# Altium project PCB_Project.PrjPcb (part 3 of 3)
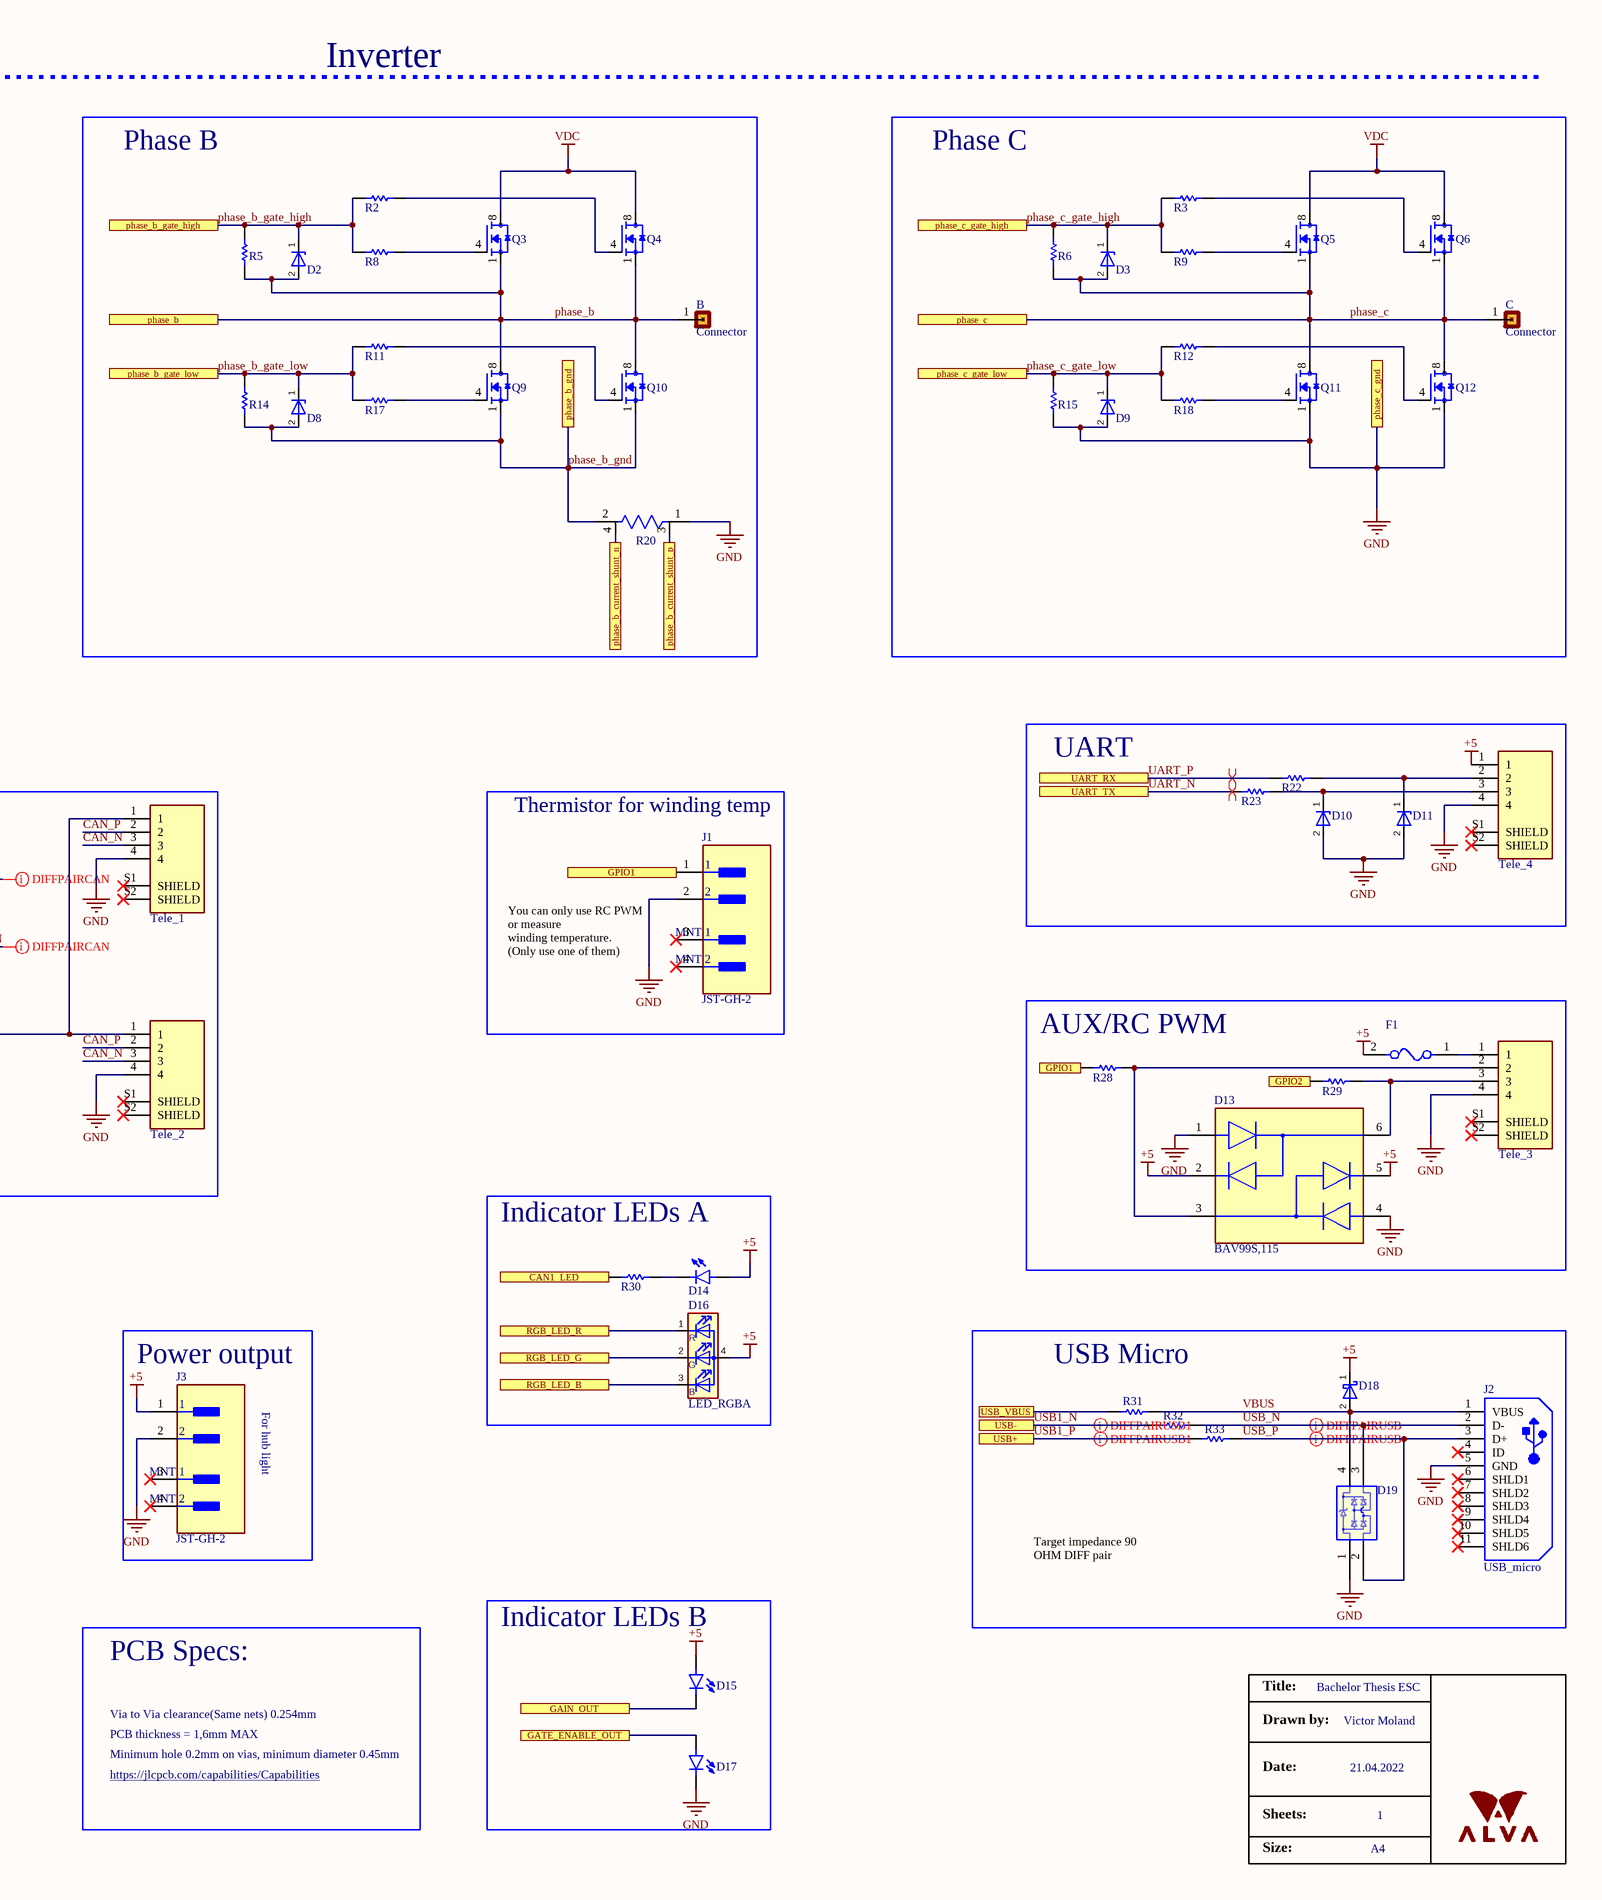
[diagram p4: thesis.SchDoc, right]

## Sheet thesis.SchDoc: Bachelor Thesis ESC (continued)

### Library data of the parts (continued)
R26 = RES_0603: Fixed Resistor, Metal Glaze/thick Film, 0.25W, 200ohm, 150V, 1% +/-Tol, 100ppm/Cel, Surface Mount, 0603; Manufacturer: Rohm; Manufacturer Part Number: ESR03EZPF2000; Rated Power Dissipation (P): 250mW; Rated Temperature: 70°C; Resistance: 200R; Temperature Coefficient: 100ppm/°C; Package Height: 0.45mm; Package Length: 1.6mm; Package Width: 0.8mm; Reference Standard: TS 16949; Supplier 1: Digi-Key; Supplier Part Number 1: RHM200ADCT-ND; RoHS: Yes; Category: Chip SMD Resistors; Stock 1: 954650; Pricing 1: 1=0,15000, 10=0,13200, 100=0,05060, 1000=0,02226, 2500=0,01923 (USD); Mount: Surface Mount; Number of Pins: 2; Package Shape: Rectangular; Size Code: 0603; Terminal Finish: Nickel; Min Operating Temperature: -55°C; Max Operating Temperature: 155°C; Tolerance: 1%; JESD-609 Code: e3; Resistor Type: FIXED RESISTOR; Construction: Chip; Package Style: SMTMeter; Packaging: Tape and Reel; Technology: METAL GLAZE/THICK FILM; Termination: Wraparound; Working Voltage: 150V; REACH SVHC: Yes; RoHS Compliant: Yes; ComponentLink1URL: https://datasheet.ciiva.com:443/pdfs/VipMasterIC/IC/ROHM/ROHM-S-A0009647586/ROHM-S-A0009647586-1.pdf?src-supplier=IHS+Markit; ComponentLink1Description: https://datasheet.ciiva.com:443/pdfs/VipMasterIC/IC/ROHM/ROHM-S-A0009647586/ROHM-S-A0009647586-1.pdf?src-supplier=IHS+Markit; ComponentLink2URL: https://datasheet.ciiva.com/2469/esr-2469706.pdf?src-supplier=Digi-Key; ComponentLink2Description: https://datasheet.ciiva.com/2469/esr-2469706.pdf?src-supplier=Digi-Key; ComponentLink3URL: https://datasheet.ciiva.com/2469/esr-2469707.pdf?src-supplier=Digi-Key; ComponentLink3Description: https://datasheet.ciiva.com/2469/esr-2469707.pdf?src-supplier=Digi-Key; ComponentLink4URL: https://datasheet.ciiva.com/2469/esr-2469708.pdf?src-supplier=Digi-Key; ComponentLink4Description: https://datasheet.ciiva.com/2469/esr-2469708.pdf?src-supplier=Digi-Key
R27 = RES_0603: Fixed Resistor, Thin Film, 0.1W, 45900ohm, 75V, 1% +/-Tol, 100ppm/Cel, Surface Mount, 0603; Manufacturer: KOA Speer; Manufacturer Part Number: RN73H1JTTD4592F100; Supplier 1: Digi-Key; Supplier Part Number 1: 2019-RN73H1JTTD4592F100CT-ND; RoHS: Yes; Category: Resistors; Stock 1: 16463; Pricing 1: 1=0,39000, 10=0,29700, 100=0,12480, 1000=0,06888, 2500=0,06458 (USD); ComponentLink1URL: https://datasheet.ciiva.com:443/pdfs/VipMasterIC/IC/KOAS/KOAS-S-A0009586296/KOAS-S-A0009586296-1.pdf?src-supplier=IHS+Markit; ComponentLink1Description: https://datasheet.ciiva.com:443/pdfs/VipMasterIC/IC/KOAS/KOAS-S-A0009586296/KOAS-S-A0009586296-1.pdf?src-supplier=IHS+Markit; ComponentLink2URL: http://www.mouser.com/ds/2/219/RN73H-12200.pdf?src-supplier=Mouser; ComponentLink2Description: http://www.mouser.com/ds/2/219/RN73H-12200.pdf?src-supplier=Mouser
R28 R29 = RES_0603: Chip Resistor; Manufacturer: Panasonic; Manufacturer Part Number: ERJ-UP3F1000V; Supplier 1: Digi-Key; Supplier Part Number 1: 10-ERJ-UP3F1000VCT-ND; RoHS: No; Category: Chip SMD Resistors; Stock 1: 5872; Pricing 1: 1=0,27000, 10=0,22800, 100=0,08920, 1000=0,03735, 2500=0,03424 (USD)
R34 = RES_0603: Fixed Resistor, Metal Glaze/thick Film, 0.1W, 510ohm, 75V, 1% +/-Tol, 100ppm/Cel, Surface Mount, 0603; Manufacturer: Panasonic; Manufacturer Part Number: ERJ-3EKF5100V; Rated Power Dissipation (P): 100mW; Rated Temperature: 70°C; Resistance: 510R; Temperature Coefficient: 100ppm/°C; Package Height: 0.45mm; Package Length: 1.6mm; Package Width: 0.8mm; Reference Standard: AEC-Q200; Supplier 1: Digi-Key; Supplier Part Number 1: P510HCT-ND; RoHS: Yes; Category: Chip SMD Resistors; Stock 1: 30608; Pricing 1: 1=0,10000, 10=0,05300, 100=0,02140, 1000=0,00961, 2500=0,00834 (USD); Mount: Surface Mount; Number of Pins: 2; Package Shape: Rectangular; Size Code: 0603; Terminal Finish: Nickel; Min Operating Temperature: -55°C; Max Operating Temperature: 155°C; Tolerance: 1%; JESD-609 Code: e3; Resistor Type: FIXED RESISTOR; Construction: Rectangular; Package Style: SMTMeter; Packaging: Tape and Reel; Technology: METAL GLAZE/THICK FILM; Termination: Wraparound; Working Voltage: 75V; REACH SVHC: Yes; RoHS Compliant: Yes; ComponentLink1URL: https://datasheet.ciiva.com:443/pdfs/VipMasterIC/IC/PANA/PANA-S-A0009889626/PANA-S-A0009889626-1.pdf?src-supplier=IHS+Markit; ComponentLink1Description: https://datasheet.ciiva.com:443/pdfs/VipMasterIC/IC/PANA/PANA-S-A0009889626/PANA-S-A0009889626-1.pdf?src-supplier=IHS+Markit; ComponentLink2URL: https://datasheet.ciiva.com/46436/426256-46436792.pdf?src-supplier=Element14; ComponentLink2Description: https://datasheet.ciiva.com/46436/426256-46436792.pdf?src-supplier=Element14; ComponentLink3URL: https://datasheet.ciiva.com/5868/426256-5868140.pdf?src-supplier=Farnell; ComponentLink3Description: https://datasheet.ciiva.com/5868/426256-5868140.pdf?src-supplier=Farnell; ComponentLink4URL: https://datasheet.ciiva.com/28565/1678782-28565126.pdf?src-supplier=Element14; ComponentLink4Description: https://datasheet.ciiva.com/28565/1678782-28565126.pdf?src-supplier=Element14; ComponentLink5URL: https://datasheet.ciiva.com/28676/1678782-28676970.pdf?src-supplier=Element14; ComponentLink5Description: https://datasheet.ciiva.com/28676/1678782-28676970.pdf?src-supplier=Element14; ComponentLink6URL: https://datasheet.ciiva.com/24027/aoa0000ce2-24027562.pdf?src-supplier=Mouser; ComponentLink6Description: https://datasheet.ciiva.com/24027/aoa0000ce2-24027562.pdf?src-supplier=Mouser; ComponentLink7URL: https://datasheet.ciiva.com/16787/70260748-16787975.pdf?src-supplier=Allied+Electronics; ComponentLink7Description: https://datasheet.ciiva.com/16787/70260748-16787975.pdf?src-supplier=Allied+Electronics; ComponentLink8URL: https://datasheet.ciiva.com/16775/70260748-16775519.pdf?src-supplier=Allied+Electronics; ComponentLink8Description: https://datasheet.ciiva.com/16775/70260748-16775519.pdf?src-supplier=Allied+Electronics; ComponentLink9URL: https://datasheet.ciiva.com/9181/aoa0000ce2-9181526.pdf?src-supplier=Avnet; ComponentLink9Description: https://datasheet.ciiva.com/9181/aoa0000ce2-9181526.pdf?src-supplier=Avnet; ComponentLink10URL: https://datasheet.ciiva.com/9181/aoa0000ce2-9181437.pdf?src-supplier=Avnet; ComponentLink10Description: https://datasheet.ciiva.com/9181/aoa0000ce2-9181437.pdf?src-supplier=Avnet; ComponentLink11URL: https://datasheet.ciiva.com/30146/aoa0000ce2-30146815.pdf?src-supplier=Onlinecomponents.com; ComponentLink11Description: https://datasheet.ciiva.com/30146/aoa0000ce2-30146815.pdf?src-supplier=Onlinecomponents.com
R35 = RES_0603: Fixed Resistor, Metal Glaze/thick Film, 0.1W, 15ohm, 75V, 1% +/-Tol, 100ppm/Cel, Surface Mount, 0603; Manufacturer: Panasonic; Manufacturer Part Number: ERJ-3EKF15R0V; Rated Power Dissipation (P): 100mW; Rated Temperature: 70°C; Resistance: 15R; Temperature Coefficient: 100ppm/°C; Package Height: 0.45mm; Package Length: 1.6mm; Package Width: 0.8mm; Reference Standard: AEC-Q200; Supplier 1: Digi-Key; Supplier Part Number 1: P15.0HCT-ND; RoHS: Yes; Category: Chip SMD Resistors; Stock 1: 131286; Pricing 1: 1=0,10000, 10=0,05300, 100=0,02140, 1000=0,00961, 2500=0,00834 (USD); Mount: Surface Mount; Number of Pins: 2; Package Shape: Rectangular; Size Code: 0603; Terminal Finish: Nickel; Min Operating Temperature: -55°C; Max Operating Temperature: 155°C; Tolerance: 1%; JESD-609 Code: e3; Resistor Type: FIXED RESISTOR; Construction: Rectangular; Package Style: SMTMeter; Packaging: Tape and Reel; Technology: METAL GLAZE/THICK FILM; Termination: Wraparound; Working Voltage: 75V; REACH SVHC: Yes; RoHS Compliant: Yes; ComponentLink1URL: https://datasheet.ciiva.com:443/pdfs/VipMasterIC/IC/PANA/PANA-S-A0009889626/PANA-S-A0009889626-1.pdf?src-supplier=IHS+Markit; ComponentLink1Description: https://datasheet.ciiva.com:443/pdfs/VipMasterIC/IC/PANA/PANA-S-A0009889626/PANA-S-A0009889626-1.pdf?src-supplier=IHS+Markit; ComponentLink2URL: https://datasheet.ciiva.com/5915/aoa0000ce2-5915293.pdf?src-supplier=Farnell; ComponentLink2Description: https://datasheet.ciiva.com/5915/aoa0000ce2-5915293.pdf?src-supplier=Farnell; ComponentLink3URL: https://datasheet.ciiva.com/46373/1678782-46373801.pdf?src-supplier=Element14; ComponentLink3Description: https://datasheet.ciiva.com/46373/1678782-46373801.pdf?src-supplier=Element14; ComponentLink4URL: https://datasheet.ciiva.com/22682/1678782-22682189.pdf?src-supplier=Element14; ComponentLink4Description: https://datasheet.ciiva.com/22682/1678782-22682189.pdf?src-supplier=Element14; ComponentLink5URL: https://datasheet.ciiva.com/46373/1678782-46373800.pdf?src-supplier=Element14; ComponentLink5Description: https://datasheet.ciiva.com/46373/1678782-46373800.pdf?src-supplier=Element14; ComponentLink6URL: https://datasheet.ciiva.com/16770/70260748-16770860.pdf?src-supplier=Allied+Electronics; ComponentLink6Description: https://datasheet.ciiva.com/16770/70260748-16770860.pdf?src-supplier=Allied+Electronics; ComponentLink7URL: https://datasheet.ciiva.com/9192/aoa0000ce2-9192958.pdf?src-supplier=Avnet; ComponentLink7Description: https://datasheet.ciiva.com/9192/aoa0000ce2-9192958.pdf?src-supplier=Avnet; ComponentLink8URL: https://datasheet.ciiva.com/30238/aoa0000ce2-30238940.pdf?src-supplier=Onlinecomponents.com; ComponentLink8Description: https://datasheet.ciiva.com/30238/aoa0000ce2-30238940.pdf?src-supplier=Onlinecomponents.com
Tele_1-Tele_4 = JST-GH-4: Conn Shrouded Header HDR 4 POS 1.25mm Solder ST Top Entry SMD T/R; Manufacturer: JST; Manufacturer Part Number: BM04B-GHS-TBT(LF)(SN)(N); Supplier 1: Digi-Key; RoHS: Yes; Category: Headers and Wire Housings; Pricing 1: 1=0,47000, 10=0,40400, 100=0,31390, 500=0,26908, 1000=0,22423 (USD); ComponentLink1URL: http://www.jst-mfg.com/product/pdf/eng/eGH.pdf?src-supplier=Digi-Key; ComponentLink1Description: http://www.jst-mfg.com/product/pdf/eng/eGH.pdf?src-supplier=Digi-Key; ComponentLink2URL: http://www.jst-mfg.com/product/pdf/eng/eGH.pdf?src-supplier=Component+Distributors+Inc.; ComponentLink2Description: http://www.jst-mfg.com/product/pdf/eng/eGH.pdf?src-supplier=Component+Distributors+Inc.; Supplier Part Number 1: 455-1580-1-ND
U1 = MCP2544FDT-E_MNY: Interface Circuit, PDSO8; Manufacturer: Microchip; Manufacturer Part Number: MCP2544FDT-E/MNY; Package Body Material: Plastic; Number of Functions: 1; Supply Voltage-Nom: 5V; Supplier 1: Digi-Key; RoHS: Yes; Category: Interface ICs; Pricing 1: 1=1,09000, 25=0,91160, 100=0,82680 (USD); Package Code: HVSON; Number of Pins: 8; Package Shape: Rectangular; Terminal Finish: Nickel; Min Operating Temperature: -40°C; Max Operating Temperature: 125°C; JESD-609 Code: e4; JESD-30 Code: R-PDSO-N8; Package Style: SMALL OUTLINE, HEAT SINK/SLUG, VERY THIN PROFILEMeter; Surface Mount: Yes; Telecom IC Type: INTERFACE CIRCUIT; Terminal Form: No Lead; Terminal Position: DUAL; Length: 3mm; Width: 2mm; Height - Seated (Max): 0.8mm; Terminal Pitch: 0.5mm; Temperature Grade: AUTOMOTIVE; REACH SVHC: Yes; RoHS Compliant: Yes; ComponentLink1URL: https://datasheet.ciiva.com:443/pdfs/VipMasterIC/IC/MCHP/MCHP-S-A0008004102/MCHP-S-A0008004102-1.pdf?src-supplier=IHS+Markit; ComponentLink1Description: https://datasheet.ciiva.com:443/pdfs/VipMasterIC/IC/MCHP/MCHP-S-A0008004102/MCHP-S-A0008004102-1.pdf?src-supplier=IHS+Markit; ComponentLink2URL: http://www.microchip.com/mymicrochip/filehandler.aspx?ddocname=en585412&src-supplier=Digi-Key; ComponentLink2Description: http://www.microchip.com/mymicrochip/filehandler.aspx?ddocname=en585412&src-supplier=Digi-Key; Supplier Part Number 1: MCP2544FDT-E/MNYDKR-ND
U2 = MAX4995A: Analog Circuit, 1 Func, BICMOS, PDSO6; Manufacturer: Maxim; Package Body Material: Plastic; Number of Functions: 1; Power Supplies: 1.8/5V; Supply Current-Max (Isup): 300uA; Supply Voltage-Max (Vsup): 5.5V; Supply Voltage-Min (Vsup): 1.7V; Supply Voltage-Nom (Vsup): 3.3V; Package Equivalence Code: TSOP6,.11,37; Qualification Status: Not Qualified; Supplier 1: Digi-Key; Manufacturer Part Number: MAX4995AAUT+T; RoHS: Yes; Category: Power Management ICs; Package Code: LSSOP; Number of Pins: 6; Package Shape: Rectangular; Terminal Finish: Nickel; Min Operating Temperature: -40°C; Max Operating Temperature: 125°C; Analog IC - Other Type: ANALOG CIRCUIT; Moisture Sensitivity Level: 1; Package Style: SMALL OUTLINE, LOW PROFILE, SHRINK PITCHMeter; Surface Mount: Yes; Technology: BICMOS; Terminal Form: Gull Wing; Terminal Position: DUAL; JESD-609 Code: e4; Peak Reflow Temperature (Cel): 260°C; JESD-30 Code: R-PDSO-G6; Length: 2.9mm; Width: 1.625mm; Height - Seated (Max): 1.45mm; Terminal Pitch: 0.95mm; Temperature Grade: AUTOMOTIVE; REACH SVHC: Yes; RoHS Compliant: Yes; ComponentLink1URL: https://datasheet.ciiva.com:443/pdfs/VipMasterIC/IC/MAXM/MAXM-S-A0009149963/MAXM-S-A0009149963-1.pdf?src-supplier=IHS+Markit; ComponentLink1Description: https://datasheet.ciiva.com:443/pdfs/VipMasterIC/IC/MAXM/MAXM-S-A0009149963/MAXM-S-A0009149963-1.pdf?src-supplier=IHS+Markit; ComponentLink2URL: https://datasheet.ciiva.com/3216/max4995a-max4995c-3216988.pdf?src-supplier=Avnet; ComponentLink2Description: https://datasheet.ciiva.com/3216/max4995a-max4995c-3216988.pdf?src-supplier=Avnet; ComponentLink3URL: https://datasheet.ciiva.com/1940/max4995a-max4995c-1940219.pdf?src-supplier=Digi-Key; ComponentLink3Description: https://datasheet.ciiva.com/1940/max4995a-max4995c-1940219.pdf?src-supplier=Digi-Key; Supplier Part Number 1: MAX4995AAUT+CT-ND
U3 = 11LC040T-E/TTTR-ND: EEPROM, 512X8, Serial, CMOS, PDSO3; Manufacturer: Microchip; Package Body Material: Plastic; Clock Frequency-Max (fCLK): 1MHz; Data Retention Time-Min: 200; Endurance: 1000000Cycles; Density: 4096b; Memory Width: 8; Number of Functions: 1; Number of Words: 512; Operating Mode: SYNCHRONOUS; Package Equivalence Code: TO-236; Power Supplies: 3/5V; Serial Bus Type: 1-WIRE; Standby Current-Max: 5uA; Supply Voltage-Max (Vsup): 5.5V; Supply Voltage-Min (Vsup): 2.5V; Supply Voltage-Nom (Vsup): 5V; Time @ Peak Reflow Temperature-Max (s): 40s; Write Cycle Time-Max (tWC): 10ms; Write Protection: SOFTWARE; Qualification Status: Not Qualified; Supplier 1: Digi-Key; Manufacturer Part Number: 11LC040T-E/TT; RoHS: Yes; Category: EEPROM; Pricing 1: 1=0,36000 (USD); Package Code: TSSOP; Number of Pins: 3; Package Shape: Rectangular; Terminal Finish: Tin; Min Operating Temperature: -40°C; Max Operating Temperature: 125°C; JESD-609 Code: e3; Memory Type: EEPROM; JESD-30 Code: R-PDSO-G3; Moisture Sensitivity Level: 1; Organization: 512X8; Package Style: SMALL OUTLINE, THIN PROFILE, SHRINK PITCHMeter; Parallel/Serial: SERIAL; Peak Reflow Temperature (Cel): 260°C; Max Supply Current: 5uA; Surface Mount: Yes; Technology: CMOS; Terminal Form: Gull Wing; Terminal Position: DUAL; Length: 2.9mm; Width: 1.3mm; Height - Seated (Max): 1.12mm; Terminal Pitch: 0.95mm; Temperature Grade: AUTOMOTIVE; REACH SVHC: Yes; RoHS Compliant: Yes; ComponentLink1URL: https://datasheet.ciiva.com:443/pdfs/VipMasterIC/IC/MCHP/MCHPS03438/MCHPS03438-1.pdf?src-supplier=IHS+Markit; ComponentLink1Description: https://datasheet.ciiva.com:443/pdfs/VipMasterIC/IC/MCHP/MCHPS03438/MCHPS03438-1.pdf?src-supplier=IHS+Markit; ComponentLink2URL: https://datasheet.ciiva.com/1909/ds-22067h-1909327.pdf?src-supplier=Digi-Key; ComponentLink2Description: https://datasheet.ciiva.com/1909/ds-22067h-1909327.pdf?src-supplier=Digi-Key; Supplier Part Number 1: 11LC040T-E/TTDKR-ND
U4 = Mitochondrik_LV: Mitochondrik
U5 = TMP235AEDBZRQ1_1: Analog Voltage Output Sensor, 500uA, 2.50Cel, Rectangular, Surface Mount; Manufacturer: Texas Instruments; Supplier 1: Digi-Key; Manufacturer Part Number: TMP235AEDBZRQ1; RoHS: Yes; Category: Integrated Circuits (ICs); Stock 1: 1926; Pricing 1: 1=0,67000, 5=0,63400, 10=0,55100, 25=0,48440, 50=0,40240, 100=0,34270, 500=0,29800, 1000=0,26075 (USD); ComponentLink1URL: https://www.ti.com:443/lit/ds/symlink/tmp235-q1.pdf?src-supplier=IHS+Markit; ComponentLink1Description: https://www.ti.com:443/lit/ds/symlink/tmp235-q1.pdf?src-supplier=IHS+Markit; Supplier Part Number 1: 296-TMP235AEDBZRQ1CT-ND

## Sheet comments.SchDoc
size A4; SheetNumber: 2; SheetTotal: 2
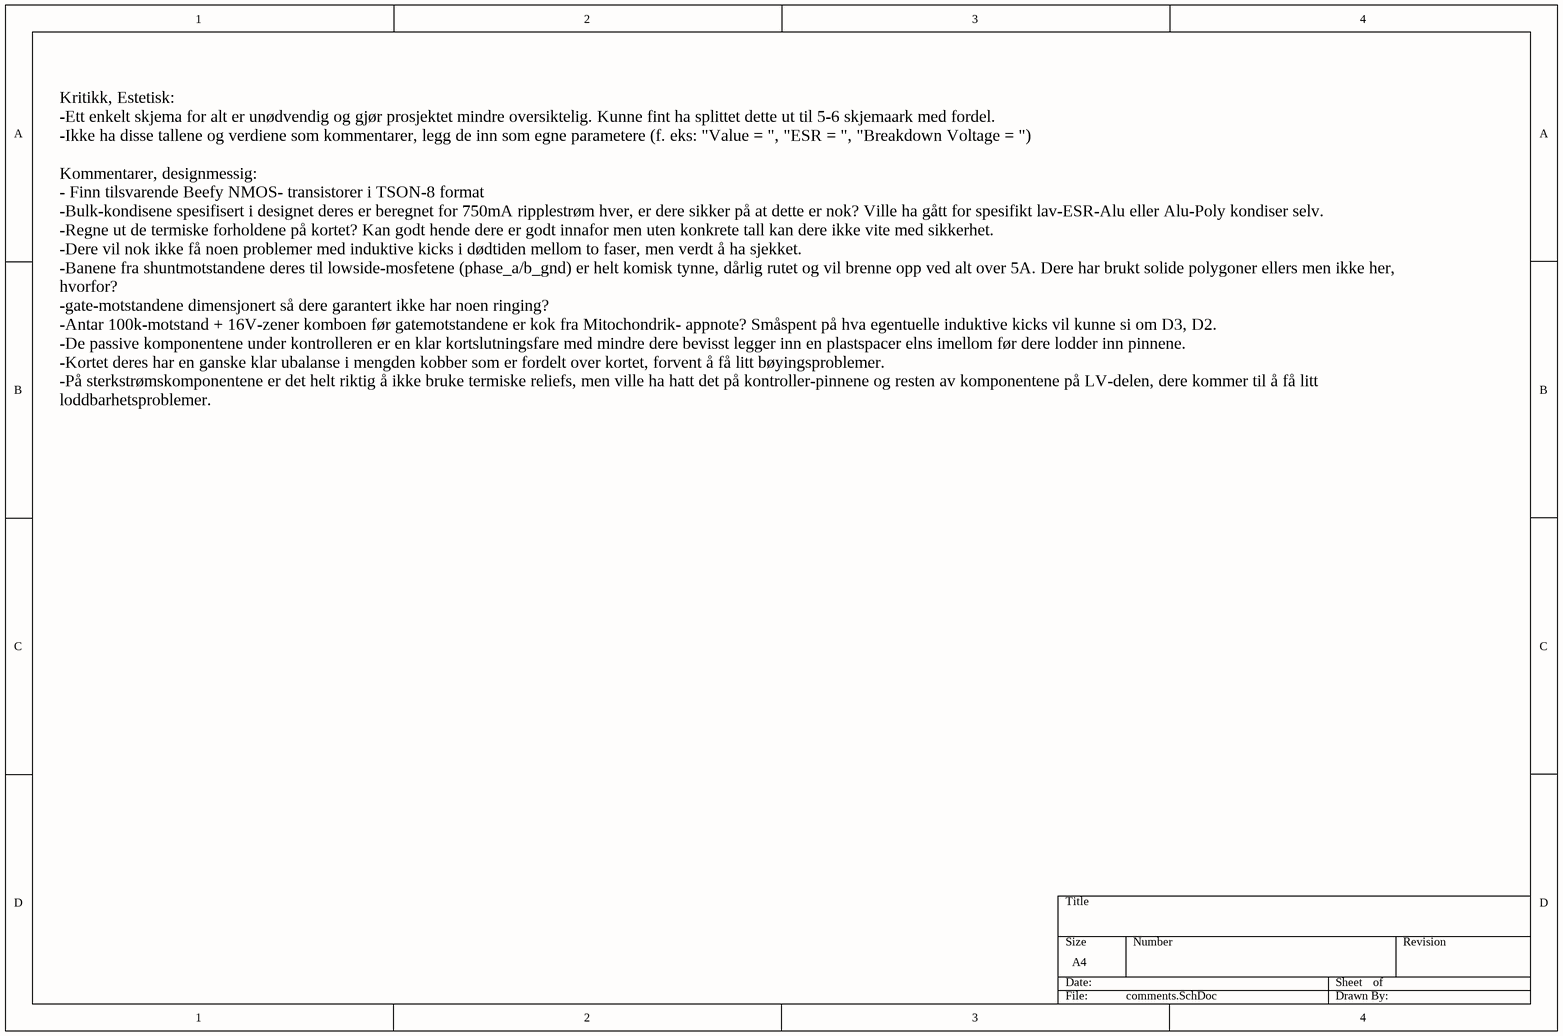
[diagram p2: comments.SchDoc]

### Notes on the sheet
- Kritikk, Estetisk:
  -Ett enkelt skjema for alt er unødvendig og gjør prosjektet mindre oversiktelig. Kunne fint ha splittet dette ut til 5-6 skjemaark med fordel.
  -Ikke ha disse tallene og verdiene som kommentarer, legg de inn som egne parametere (f. eks: "Value = ", "ESR = ", "Breakdown Voltage = ")
  Kommentarer, designmessig:
  - Finn tilsvarende Beefy NMOS- transistorer i TSON-8 format
  -Bulk-kondisene spesifisert i designet deres er beregnet for 750mA ripplestrøm hver, er dere sikker på at dette er nok? Ville ha gått for spesifikt lav-ESR-Alu eller Alu-Poly kondiser selv.
  -Regne ut de termiske forholdene på kortet? Kan godt hende dere er godt innafor men uten konkrete tall kan dere ikke vite med sikkerhet.
  -Dere vil nok ikke få noen problemer med induktive kicks i dødtiden mellom to faser, men verdt å ha sjekket.
  -Banene fra shuntmotstandene deres til lowside-mosfetene (phase_a/b_gnd) er helt komisk tynne, dårlig rutet og vil brenne opp ved alt over 5A. Dere har brukt solide polygoner ellers men ikke her, hvorfor?
  -gate-motstandene dimensjonert så dere garantert ikke har noen ringing?
  -Antar 100k-motstand + 16V-zener komboen før gatemotstandene er kok fra Mitochondrik- appnote? Småspent på hva egentuelle induktive kicks vil kunne si om D3, D2.
  -De passive komponentene under kontrolleren er en klar kortslutningsfare med mindre dere bevisst legger inn en plastspacer elns imellom før dere lodder inn pinnene.
  -Kortet deres har en ganske klar ubalanse i mengden kobber som er fordelt over kortet, forvent å få litt bøyingsproblemer.
  -På sterkstrømskomponentene er det helt riktig å ikke bruke termiske reliefs, men ville ha hatt det på kontroller-pinnene og resten av komponentene på LV-delen, dere kommer til å få litt loddbarhetsproblemer.